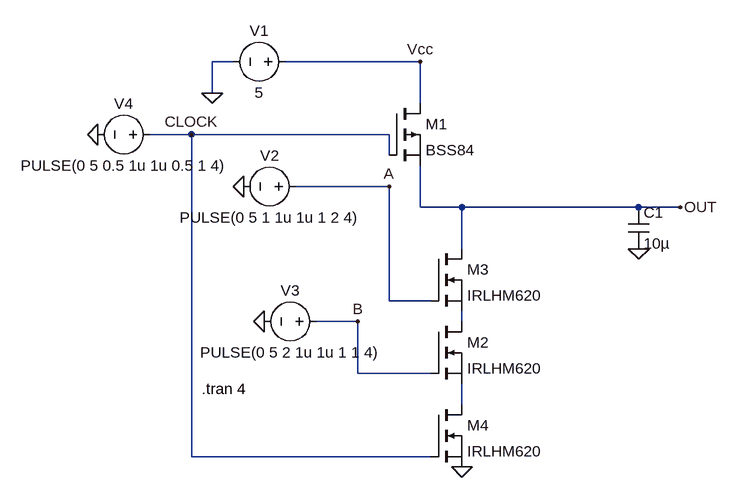
[diagram p0: schematic AND DYN.asc]
AND DYN.asc, the LTspice schematic file:
Version 4.1
SHEET 1 1360 680
WIRE -128 -16 -160 -16
WIRE 160 -16 -48 -16
WIRE -160 32 -160 -16
WIRE 160 48 160 -16
WIRE -192 96 -256 96
WIRE 112 96 -192 96
WIRE 112 128 112 96
WIRE 112 176 -32 176
WIRE 160 208 160 144
WIRE 224 208 160 208
WIRE 496 208 224 208
WIRE 560 208 496 208
WIRE 224 272 224 208
WIRE 112 352 112 176
WIRE 176 352 112 352
WIRE 64 384 0 384
WIRE 224 384 224 368
WIRE 64 464 64 384
WIRE 176 464 64 464
WIRE 224 512 224 480
WIRE -192 592 -192 96
WIRE 176 592 -192 592
FLAG -160 32 0
FLAG 160 -16 Vcc
FLAG -112 176 0
FLAG -80 384 0
FLAG 112 176 A
FLAG 64 384 B
FLAG -336 96 0
FLAG -192 96 CLOCK
FLAG 560 208 OUT
FLAG 224 608 0
FLAG 496 272 0
SYMBOL pmos 112 48 R0
SYMATTR InstName M1
SYMATTR Value BSS84
SYMBOL voltage -32 -16 R90
WINDOW 0 -32 56 VBottom 2
WINDOW 3 32 56 VTop 2
WINDOW 123 0 0 Left 0
WINDOW 39 0 0 Left 0
SYMATTR InstName V1
SYMATTR Value 5
SYMBOL nmos 176 272 R0
SYMATTR InstName M3
SYMATTR Value IRLHM620
SYMBOL voltage -16 176 R90
WINDOW 0 -32 56 VBottom 2
WINDOW 3 32 56 VTop 2
WINDOW 123 0 0 Left 0
WINDOW 39 0 0 Left 0
SYMATTR InstName V2
SYMATTR Value PULSE(0 5 1 1u 1u 1 2 4)
SYMBOL voltage 16 384 R90
WINDOW 0 -32 56 VBottom 2
WINDOW 3 32 56 VTop 2
WINDOW 123 0 0 Left 0
WINDOW 39 0 0 Left 0
SYMATTR InstName V3
SYMATTR Value PULSE(0 5 2 1u 1u 1 1 4)
SYMBOL voltage -240 96 R90
WINDOW 0 -32 56 VBottom 2
WINDOW 3 32 56 VTop 2
WINDOW 123 0 0 Left 0
WINDOW 39 0 0 Left 0
SYMATTR InstName V4
SYMATTR Value PULSE(0 5 0.5 1u 1u 0.5 1 4)
SYMBOL nmos 176 384 R0
SYMATTR InstName M2
SYMATTR Value IRLHM620
SYMBOL nmos 176 512 R0
SYMATTR InstName M4
SYMATTR Value IRLHM620
SYMBOL cap 480 208 R0
SYMATTR InstName C1
SYMATTR Value 10µ
TEXT -176 488 Left 2 !.tran 4

The netlist it stands for:
* AND DYN.asc
M1 Vcc CLOCK OUT OUT BSS84
V1 Vcc 0 5
M3 OUT A N001 N001 IRLHM620
V2 A 0 PULSE(0 5 1 1u 1u 1 2 4)
V3 B 0 PULSE(0 5 2 1u 1u 1 1 4)
V4 CLOCK 0 PULSE(0 5 0.5 1u 1u 0.5 1 4)
M2 N001 B N002 N002 IRLHM620
M4 N002 CLOCK 0 0 IRLHM620
C1 OUT 0 10µ
.model NMOS NMOS
.model PMOS PMOS
.lib standard.mos
.tran 4
.backanno
.end